# Altium schematic sheet adc.SchDoc
size Letter; DocumentNumber: 6; SheetNumber: 6; SheetTotal: 6
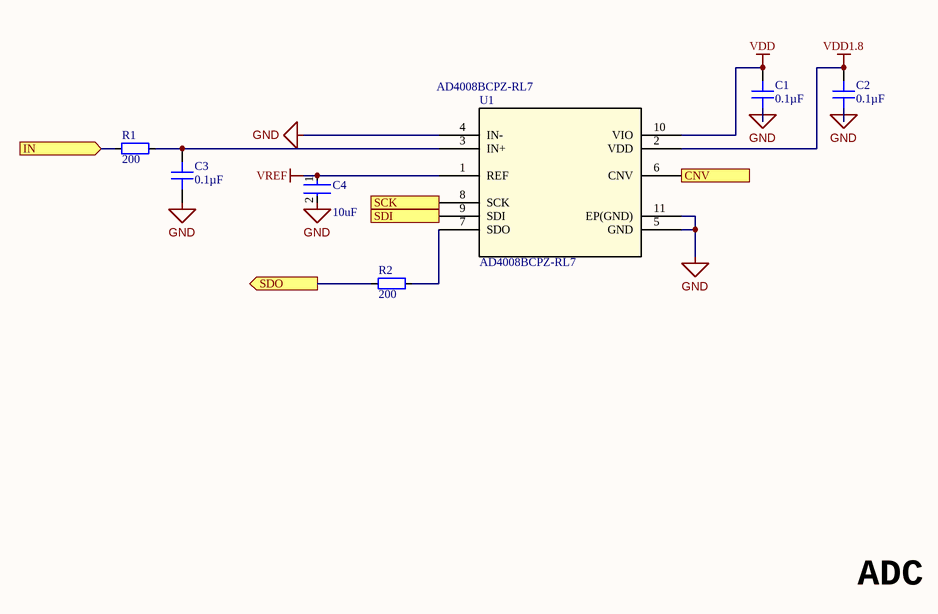
[diagram p0: adc.SchDoc]

## Parts
C1  0.1µF  [FP-GRM155-0_05-IPC_B]
C2  0.1µF  [FP-GRM155-0_05-IPC_B]
C3  0.1µF  [FP-GRM155-0_05-IPC_B]
C4  Capacitance: 10uF  [FP-CL21-IPC_C]  (hidden comment: CL21B106KQQNNNG)
R1  value 200  [FP-CRCW0402-e3-IPC_B]  (hidden comment: Res_0402)
R2  value 200  [FP-CRCW0402-e3-IPC_B]  (hidden comment: Res_0402)
U1  AD4008BCPZ-RL7  [CP_10_9]

## Ports
CNV (in), IN (in), SCK (in), SDI (in), SDO (out)

## Nets
GND: C1.2 C2.2 C3.2 C4.2 U1.4(IN-) U1.5(GND) U1.11(EP(GND))
VDD: C1.1 U1.10(VIO)
VDD1.8: C2.1 U1.2(VDD)
VREF: C4.1 U1.1(REF)
CNV: U1.6(CNV) ; port CNV
IN: R1.1 ; port IN
SCK: U1.8(SCK) ; port SCK
SDI: U1.9(SDI) ; port SDI
SDO: R2.1 ; port SDO
NetC3_1: C3.1 R1.2 U1.3(IN+)
NetR2_2: R2.2 U1.7(SDO)

## Notes on the sheet
- ADC

## Library data of the parts
C1-C3 = 04023C104KAT2A: CAP CER 0.1UF 25V X7R 0402; Manufacturer: AVX Corporation; Tolerance: ±10%; Value: 0.1µF; ComponentLink1Description: Datasheet; ComponentLink1URL: http://datasheets.avx.com/X7RDielectric.pdf; Supplier 1: DigiKey; Supplier Part Number 1: 478-7868-1-ND; Part Number: 04023C104KAT2A; Applications: General Purpose; Capacitance: 0.1µF; ComponentLink2Description: DigiKey Link; ComponentLink2URL: http://digikey.com/product-detail/en/avx-corporation/04023C104KAT2A/478-7868-1-ND/3881491; Device Package: 0402 (1005 Metric); LastUpdated: 9/2/2020 1:02:21 AM; Lifecycle Status: Active; Minimum Order: 1; Mounting Type: Surface Mount, MLCC; Operating Temperature: -55°C ~ 125°C; Package / Case: 0402 (1005 Metric); Packaging: CutTape; PartId: 3190; Part Status: Active; Price: 0.13; Series: -; Size / Dimension: 0.039" L x 0.020" W (1.00mm x 0.50mm); Temperature Coefficient: X7R; Thickness (Max): 0.022" (0.55mm); Voltage - Rated: 25V
C4 = CMP-13271-001427-1: CL21 Series 0805 10uF 6.3V ±10% Tolerance X7R Multilayer Ceramic Chip Capacitor; Min Operating Temperature: -55°C; Dielectric: X7R; Voltage Rating: 6.3V; Case/Package: 0805; Height: 1.25mm; Case Code (Metric): 2012; Tolerance: 10%; Packaging: Tape and Reel; Thickness: 0.055inch; Voltage: 6.3V; Max Operating Temperature: 125°C; Lead Free: Lead Free; Package Quantity: 3000; Case Code (Imperial): 0805; Depth: 1.25mm; Width: 0.049inch; Length: 2mm; Mount: Surface Mount
R1 R2 = Res_0402: Resistor
U1 = AD4008BCPZ-RL7: 16-Bit, 2 MSPS/1 MSPS/500 kSPS, / Precision, Pseudo Differential, SAR ADCs; Value: Value; Type: Type; RefDes: RefDes; Supplier 1: Arrow Electronics; Supplier Part Number 1: AD4008BCPZ-RL7